# EAGLE schematic H18R11 (EAGLE 9.6.1)

## Sheet 1 of 3
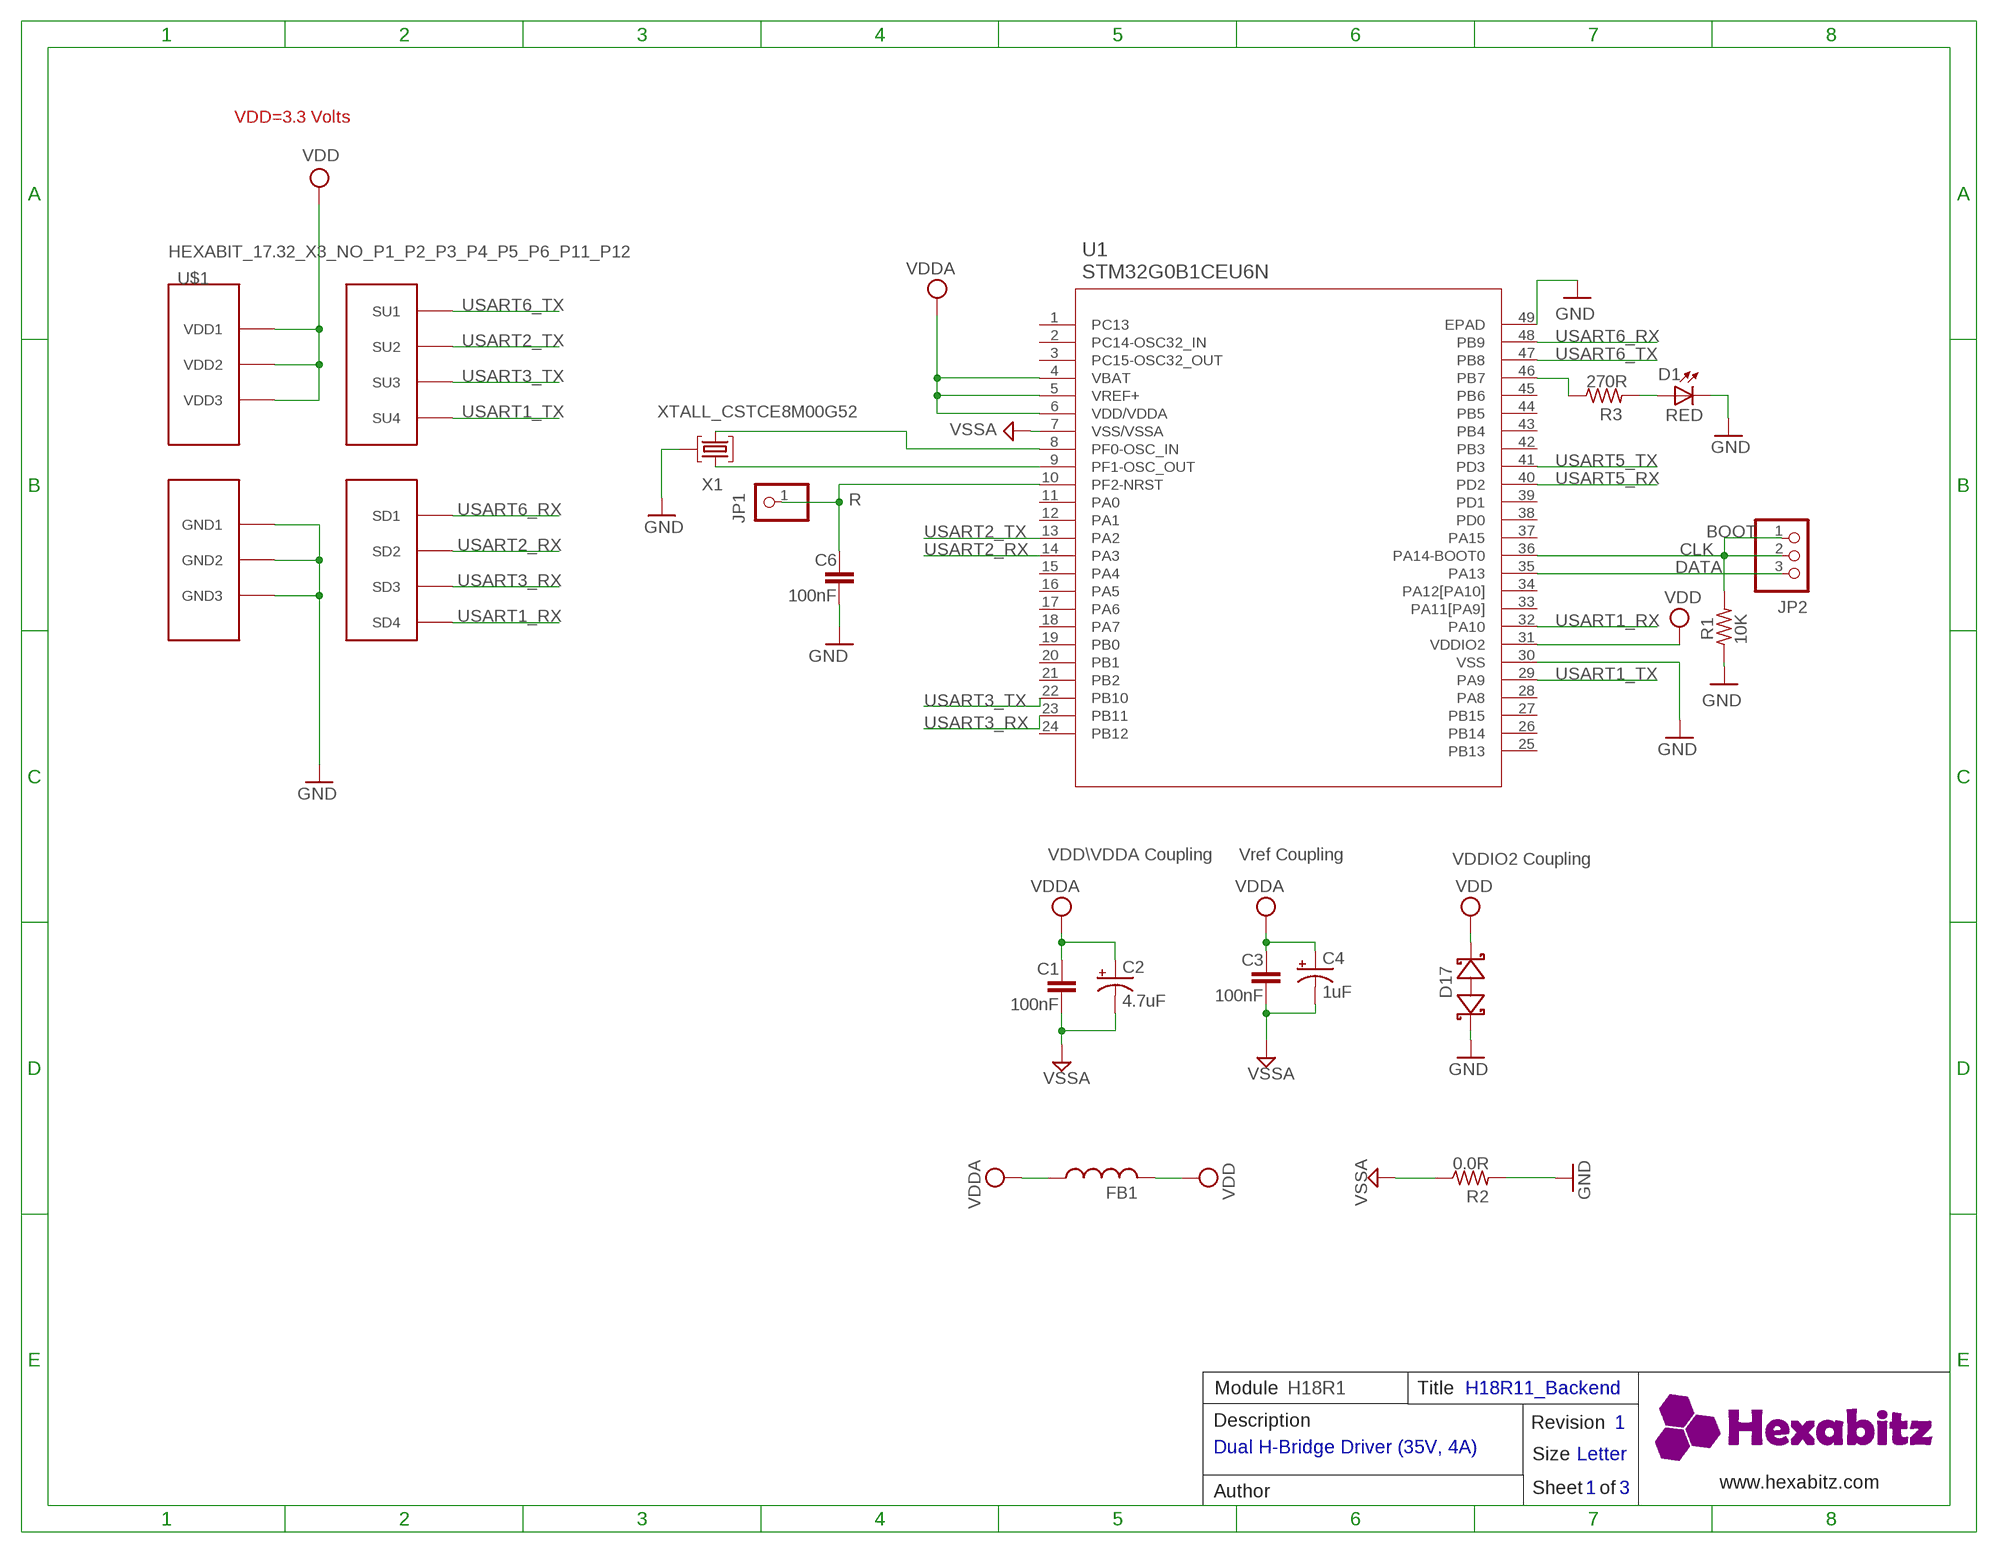
[diagram p0: schematic, sheet 1]

### Parts
C1  100nF  C-0603  [C-0603]
C2  4.7uF  C-0805-POL  [C-0805-POL]
C3  100nF  C-0603  [C-0603]
C4  1uF  C-0805-POL  [C-0805-POL]
C6  100nF  C-0603  [C-0603]
D1  RED  VLMS1300-GS08  [VLMS1300-GS08]
D17  BOURNS_CDSOD323-T03SCBOURNS_CDSOD323-T03SC_0_0  [BOURNS_CDSOD323-T03SC_0]
FB1  FB-0603  [FB-0603]
JP1  R  PINHD-1X1  [1X01]
JP2  PINHD-1X3  [1X03]
R1  10K  R-0603  [R-0603]
R2  0.0R  R-0603  [R-0603]
R3  270R  R-0603  [R-0603]
U1  STM32G0B1CEU6N  [HEXABITZ_ICS_QFN_B1CEU6_STM-L]
U$1  HEXABIT_17.32_X3_NO_P1_P2_P3_P4_P5_P6_P11_P12  [HEXABIT_17.32_X3_NO_P1_P2_P3_P4_P5_P6_P11_P12]
X1  XTALL_CSTCE8M00G52  [XTALL_CSTCE8M00G52]

### Nets
CLK: JP2.1 JP2.2 R1.2 U1.36(PA14-BOOT0)
DATA: JP2.3 U1.35(PA13)
GND: C6.2 D1.C D17.1(A) R1.1 R2.2 U1.30(VSS) U1.49(EPAD) U$1.PAD_PD12(GND1) U$1.PAD_PD17(GND2) U$1.PAD_PD19(GND3) X1.P$2 ; also sheet 2,3
N$1: D1.A R3.2
N$2: R3.1 U1.46(PB7)
N$5: U1.9(PF1-OSC_OUT) X1.P$1
N$6: U1.8(PF0-OSC_IN) X1.P$3
N$8: C6.1 JP1.1 U1.10(PF2-NRST)
USART1_RX: U1.32(PA10) U$1.PAD_PD8(SD4)
USART1_TX: U1.29(PA9) U$1.PAD_PU8(SU4)
USART2_RX: U1.14(PA3) U$1.PAD_PD1(SD2)
USART2_TX: U1.13(PA2) U$1.PAD_PU1(SU2)
USART3_RX: U1.23(PB11) U$1.PAD_PD2(SD3)
USART3_TX: U1.22(PB10) U$1.PAD_PU2(SU3)
USART5_RX: U1.40(PD2)
USART5_TX: U1.41(PD3)
USART6_RX: U1.48(PB9) U$1.PAD_PD3(SD1)
USART6_TX: U1.47(PB8) U$1.PAD_PU3(SU1)
VDD: D17.2(C) FB1.2 U1.31(VDDIO2) U$1.PAD_PU12(VDD1) U$1.PAD_PU17(VDD2) U$1.PAD_PU19(VDD3) ; also sheet 2,3
VDDA: C1.1 C2.1(+) C3.1 C4.1(+) FB1.1 U1.4(VBAT) U1.5(VREF+) U1.6(VDD/VDDA)
VSSA: C1.2 C2.2(-) C3.2 C4.2(-) R2.1 U1.7(VSS/VSSA) ; also sheet 2
Unconnected: U1.1(PC13) U1.2(PC14-OSC32_IN) U1.3(PC15-OSC32_OUT) U1.11(PA0) U1.12(PA1) U1.15(PA4) U1.16(PA5) U1.17(PA6) U1.18(PA7) U1.19(PB0) U1.20(PB1) U1.21(PB2) U1.24(PB12) U1.25(PB13) U1.26(PB14) U1.27(PB15) U1.28(PA8) U1.33(PA11[PA9]) U1.34(PA12[PA10]) U1.37(PA15) U1.38(PD0) U1.39(PD1) U1.42(PB3) U1.43(PB4) U1.44(PB5) U1.45(PB6)

### Notes on the sheet
- VDD=3.3 Volts
- BOOT
- VDD\VDDA Coupling | Vref Coupling | VDDIO2 Coupling
- Module | H18R1 | Title | H18R11_Backend
- Description | Revision | 1
- Dual H-Bridge Driver (35V, 4A)
- Size | Letter
- www.hexabitz.com
- Author | Sheet   of | 1 | 3
- C:/Users/Admin/Desktop/logodraft.bmp

## Sheet 2 of 3
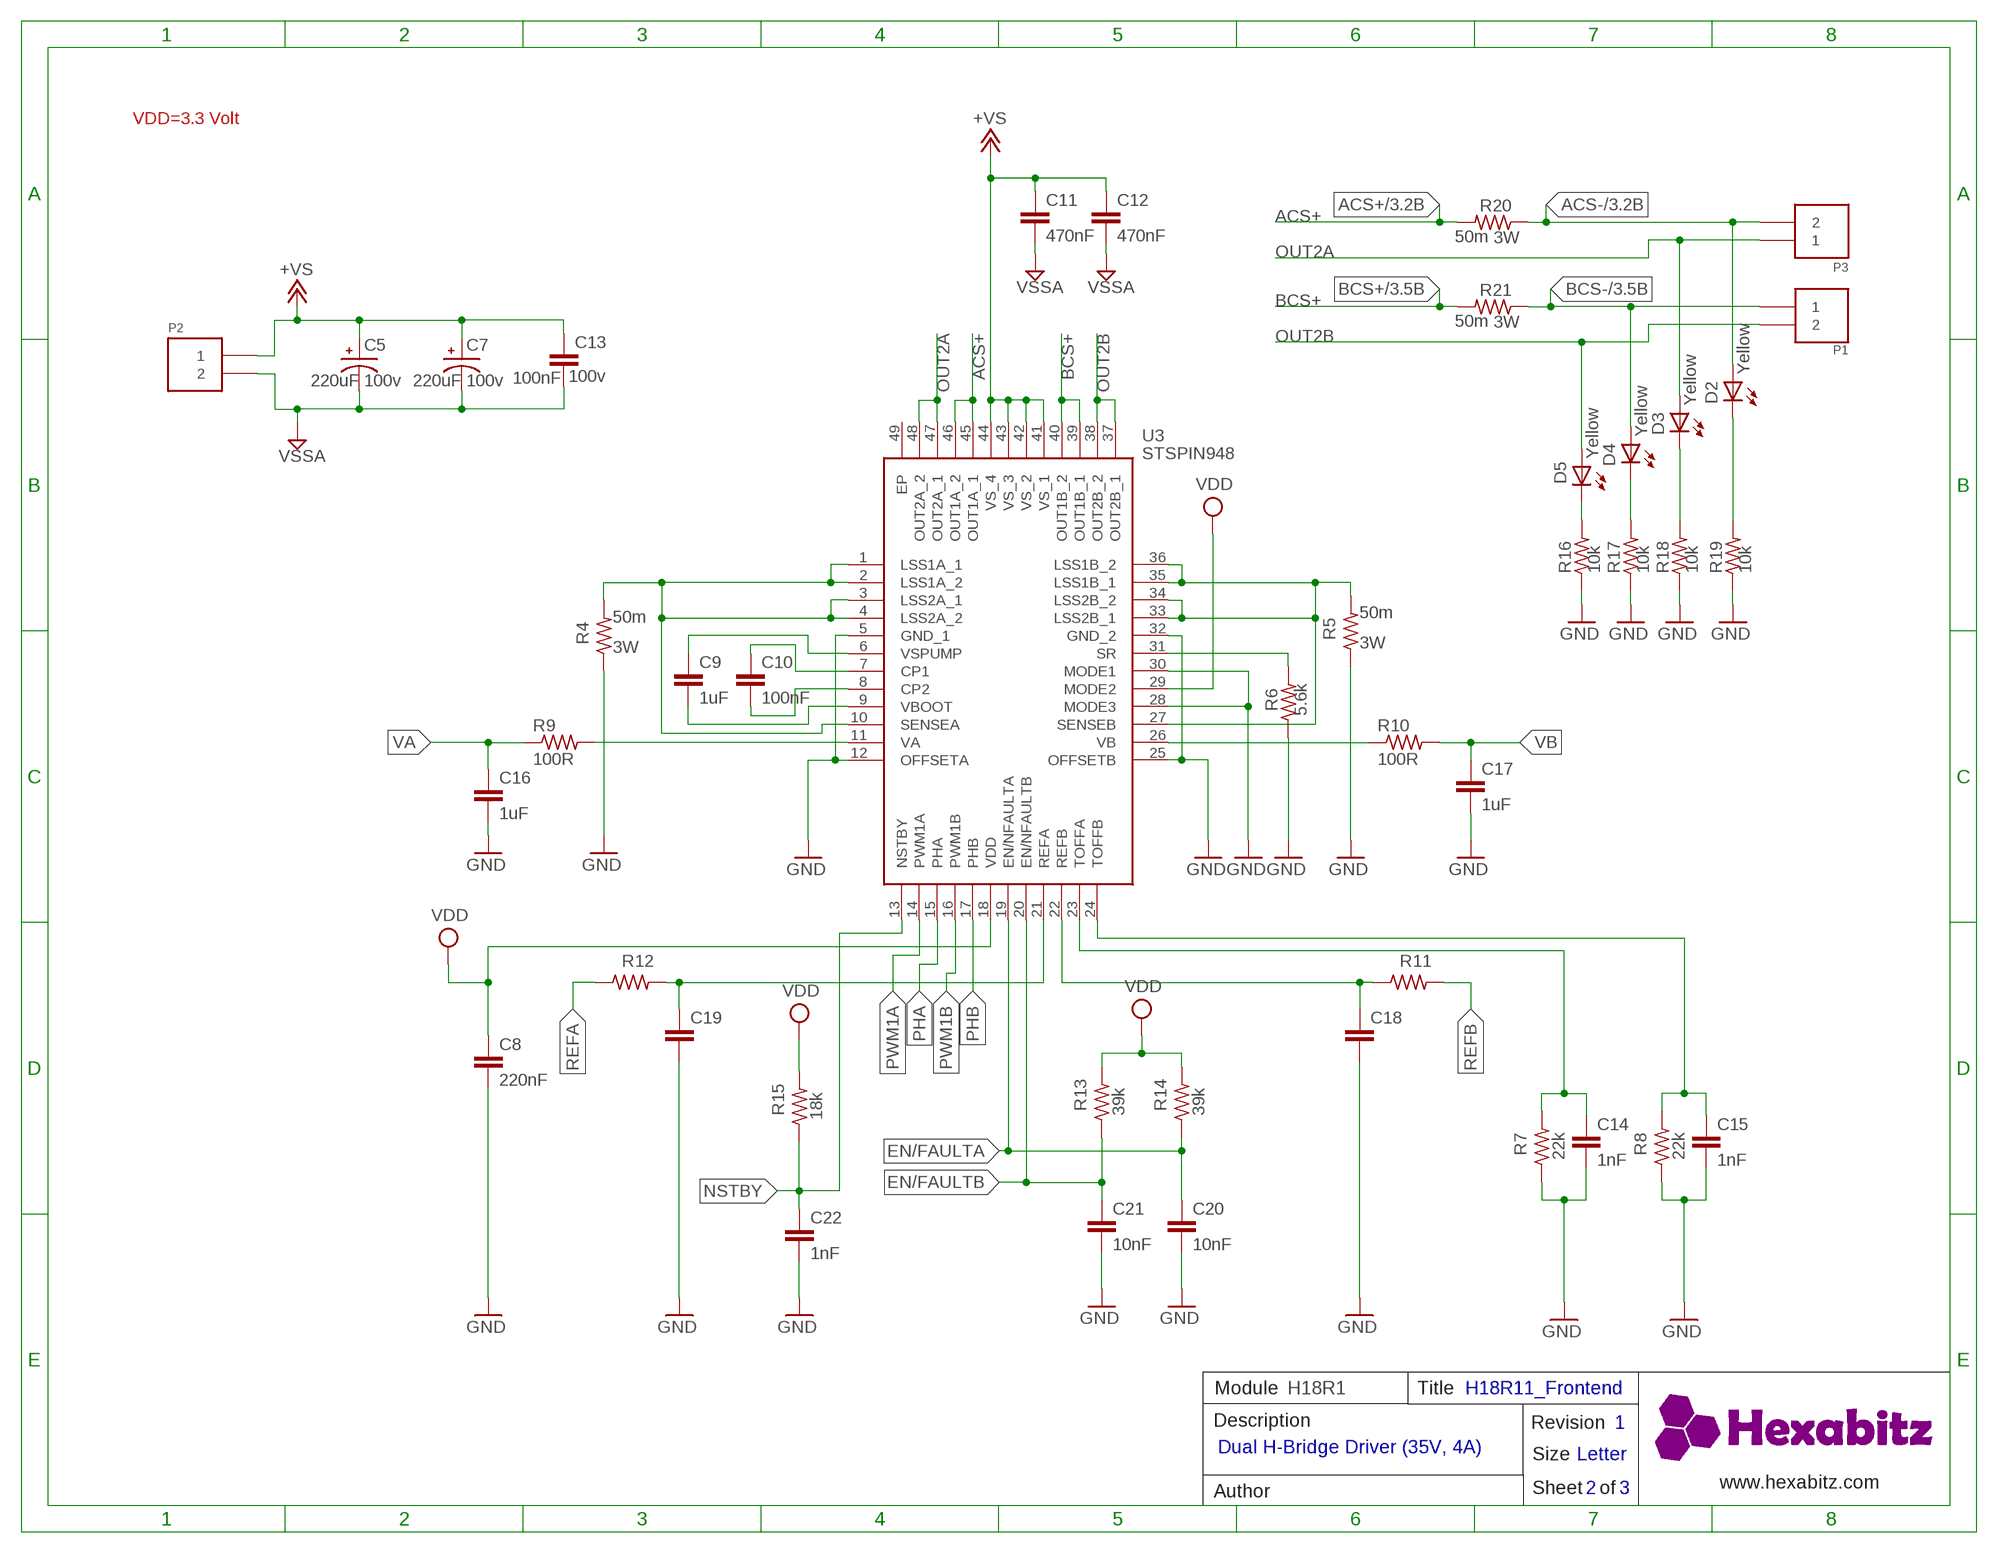
[diagram p1: schematic, sheet 2]

### Parts
C5  220uF  EEUFS2A221B  [CAPPRD500W60D1250H2500]
C7  220uF  EEUFS2A221B  [CAPPRD500W60D1250H2500]
C8  220nF  C-0603  [C-0603]
C9  1uF  C-0603  [C-0603]
C10  100nF  C-0603  [C-0603]
C11  470nF  C-0603  [C-0603]
C12  470nF  C-0603  [C-0603]
C13  100nF  C-0603  [C-0603]
C14  1nF  C-0603  [C-0603]
C15  1nF  C-0603  [C-0603]
C16  1uF  C-0603  [C-0603]
C17  1uF  C-0603  [C-0603]
C18  C-0603  [C-0603]
C19  C-0603  [C-0603]
C20  10nF  C-0603  [C-0603]
C21  10nF  C-0603  [C-0603]
C22  1nF  C-0603  [C-0603]
D2  Yellow  VLMS1300-GS08  [VLMS1300-GS08]
D3  Yellow  VLMS1300-GS08  [VLMS1300-GS08]
D4  Yellow  VLMS1300-GS08  [VLMS1300-GS08]
D5  Yellow  VLMS1300-GS08  [VLMS1300-GS08]
P1  1546111-2  [1546111-2]
P2  1546111-2  [1546111-2]
P3  1546111-2  [1546111-2]
R4  50m  R-US_R2512  [R2512]
R5  50m  R-US_R2512  [R2512]
R6  5.6k  R-0603  [R-0603]
R7  22k  R-0603  [R-0603]
R8  22k  R-0603  [R-0603]
R9  100R  R-0603  [R-0603]
R10  100R  R-0603  [R-0603]
R11  R-0603  [R-0603]
R12  R-0603  [R-0603]
R13  39k  R-0603  [R-0603]
R14  39k  R-0603  [R-0603]
R15  18k  R-0603  [R-0603]
R16  10k  R-0805  [R-0805]
R17  10k  R-0805  [R-0805]
R18  10k  R-0805  [R-0805]
R19  10k  R-0805  [R-0805]
R20  50m  R-US_R2512  [R2512]
R21  50m  R-US_R2512  [R2512]
U3  STSPIN948  [QFN50P700X700X105-49N]

### Nets
+VS: C5.P C7.P C11.1 C12.1 C13.1 P2.1 U3.41(VS_1) U3.42(VS_2) U3.43(VS_3) U3.44(VS_4)
ACS+: R20.2 U3.45(OUT1A_1) U3.46(OUT1A_2) ; also sheet 3
ACS-: D2.A P3.2 R20.1 ; also sheet 3
BCS+: R21.2 U3.39(OUT1B_1) U3.40(OUT1B_2) ; also sheet 3
BCS-: D4.A P1.1 R21.1 ; also sheet 3
EN/FAULTA: C20.1 R14.1 U3.19(EN/NFAULTA)
EN/FAULTB: C21.1 R13.1 U3.20(EN/NFAULTB)
GND: C8.2 C14.2 C15.2 C16.2 C17.2 C18.2 C19.2 C20.2 C21.2 C22.2 R4.1 R5.1 R6.1 R7.1 R8.1 R16.1 R17.1 R18.1 R19.1 U3.5(GND_1) U3.12(OFFSETA) U3.25(OFFSETB) U3.28(MODE3) U3.30(MODE1) U3.32(GND_2) ; also sheet 1,3
N$3: C9.1 U3.6(VSPUMP)
N$4: C9.2 U3.9(VBOOT)
N$7: C10.1 U3.7(CP1)
N$9: C10.2 U3.8(CP2)
N$10: R4.2 U3.1(LSS1A_1) U3.2(LSS1A_2) U3.3(LSS2A_1) U3.4(LSS2A_2) U3.10(SENSEA)
N$11: R5.2 U3.27(SENSEB) U3.33(LSS2B_1) U3.34(LSS2B_2) U3.35(LSS1B_1) U3.36(LSS1B_2)
N$12: R6.2 U3.31(SR)
N$13: C14.1 R7.2 U3.23(TOFFA)
N$14: R9.2 U3.11(VA)
N$15: R10.1 U3.26(VB)
N$16: C15.1 R8.2 U3.24(TOFFB)
N$17: C19.1 R12.2 U3.21(REFA)
N$18: C18.1 R11.1 U3.22(REFB)
N$19: D3.C R18.2
N$21: D5.C R16.2
N$22: D4.C R17.2
N$23: D2.C R19.2
NSTBY: C22.1 R15.1 U3.13(NSTBY)
OUT2A: D3.A P3.1 U3.47(OUT2A_1) U3.48(OUT2A_2)
OUT2B: D5.A P1.2 U3.37(OUT2B_1) U3.38(OUT2B_2)
PHA: U3.15(PHA)
PHB: U3.17(PHB)
PWM1A: U3.14(PWM1A)
PWM1B: U3.16(PWM1B)
REFA: R12.1
REFB: R11.2
VA: C16.1 R9.1
VB: C17.1 R10.2
VDD: C8.1 R13.2 R14.2 R15.2 U3.18(VDD) U3.29(MODE2) ; also sheet 1,3
VSSA: C5.N C7.N C11.2 C12.2 C13.2 P2.2 ; also sheet 1
Unconnected: U3.49(EP)

### Notes on the sheet
- VDD=3.3 Volt
- Module | H18R1 | Title | H18R11_Frontend
- Description | Revision | 1
- Dual H-Bridge Driver (35V, 4A)
- Size | Letter
- www.hexabitz.com
- Author | Sheet   of | 2 | 3
- C:/Users/Admin/Desktop/logodraft.bmp

## Sheet 3 of 3
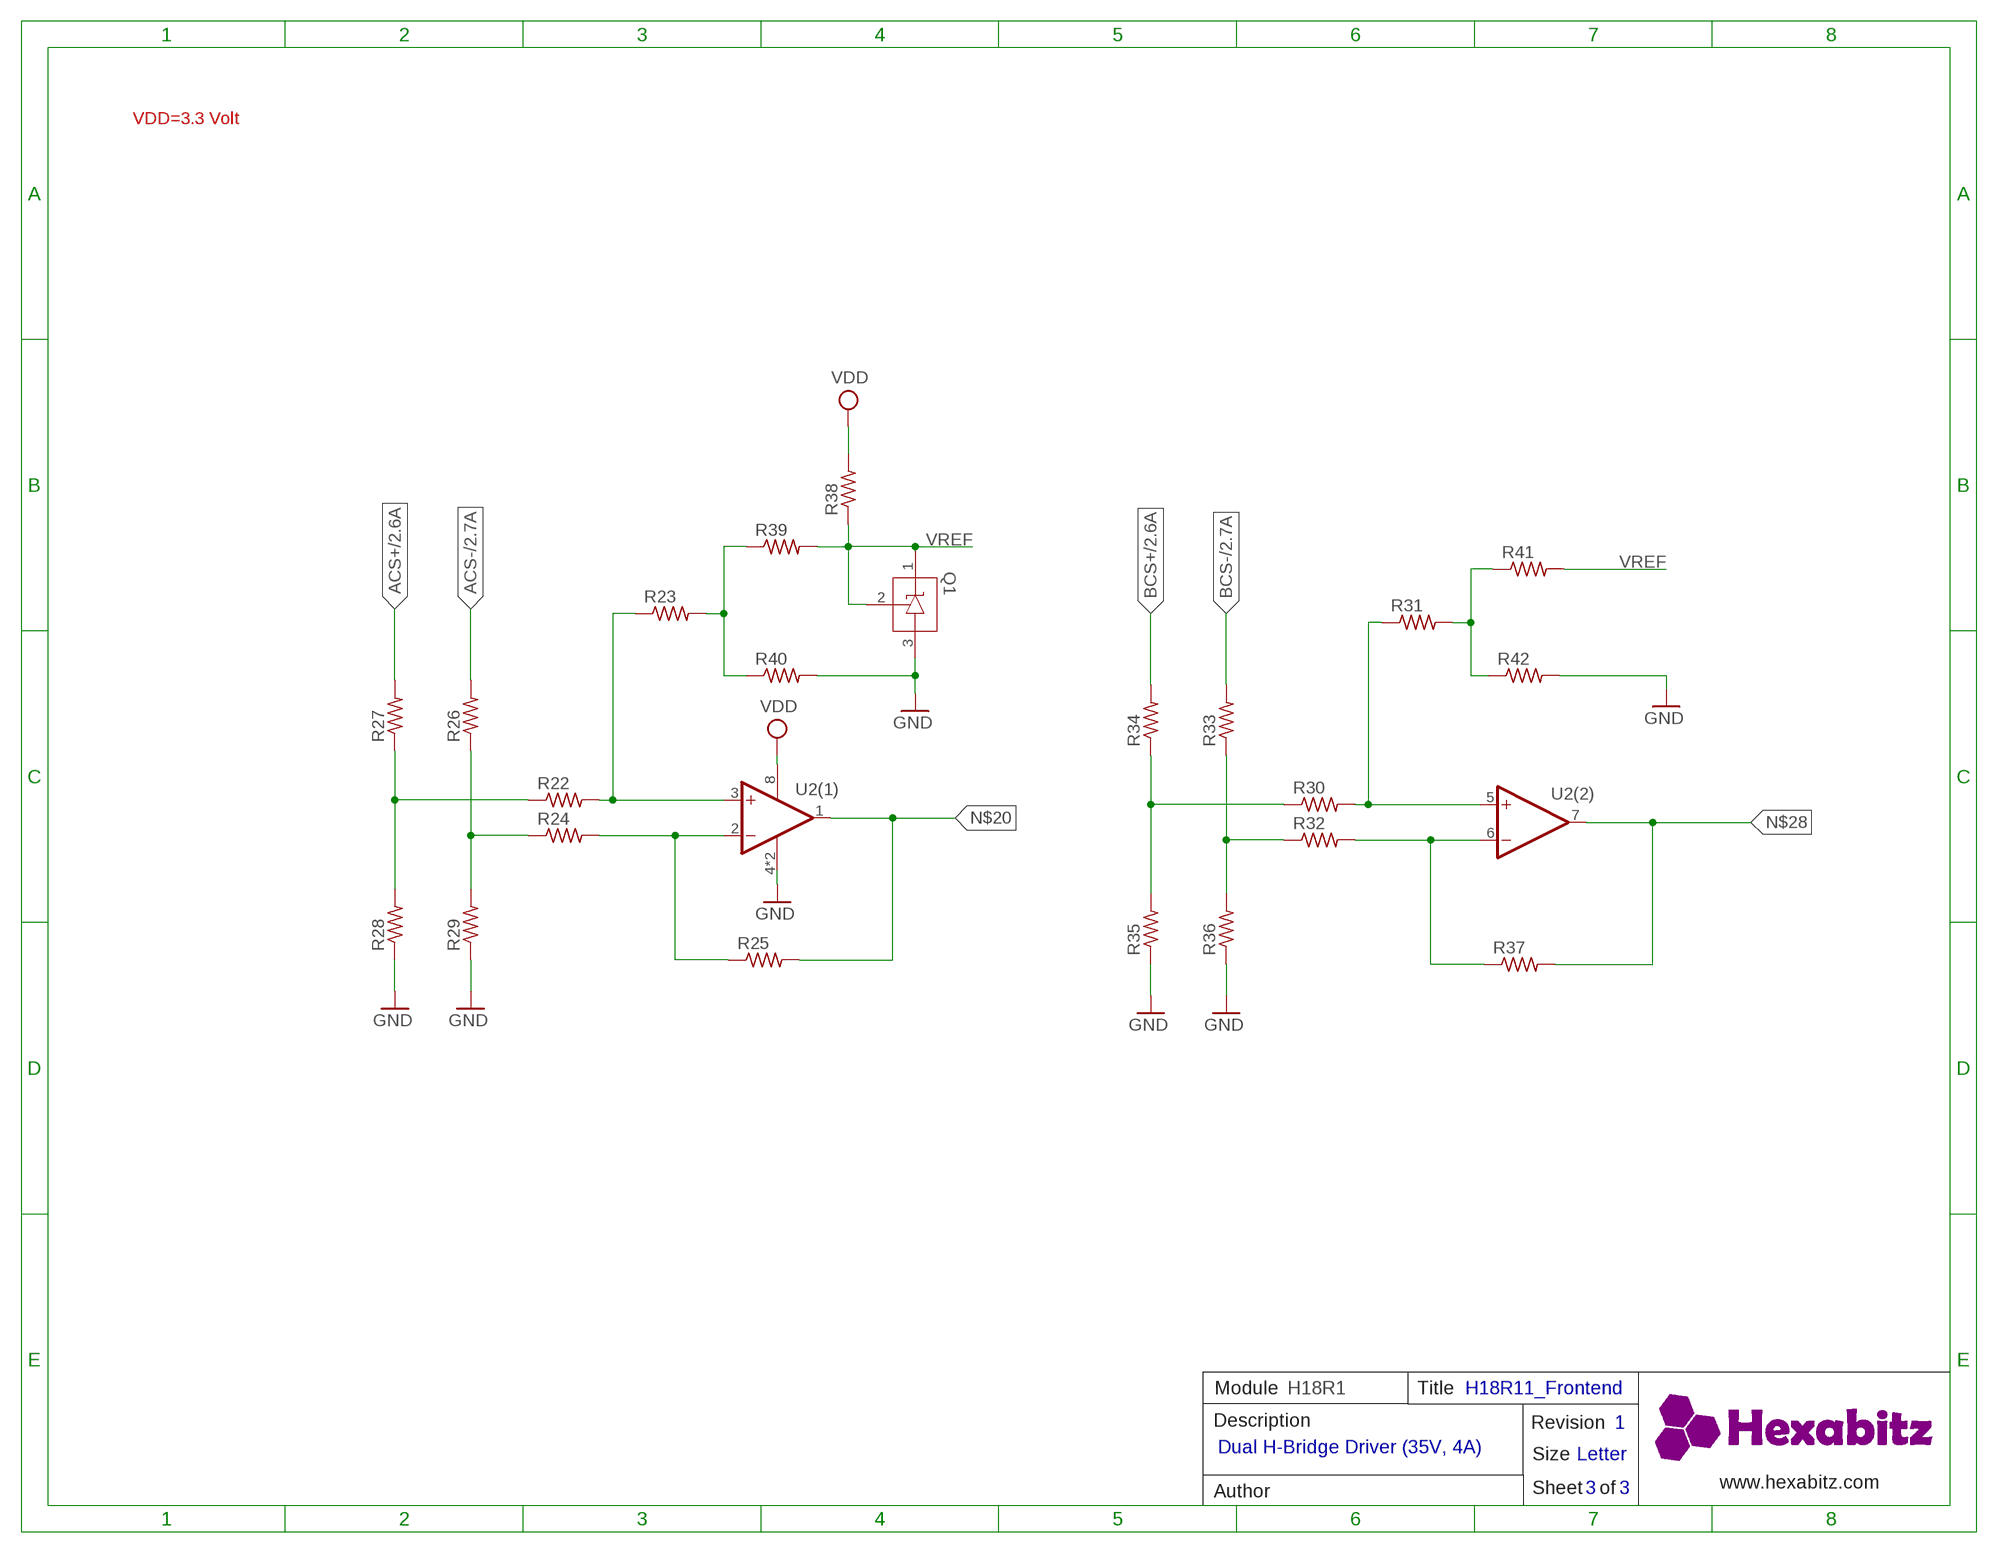
[diagram p2: schematic, sheet 3]

### Parts
Q1  TL431QDBZR,215  [SOT23_TO-236AB_NEX]
R22  R-0402  [R-0402]
R23  R-0402  [R-0402]
R24  R-0402  [R-0402]
R25  R-0402  [R-0402]
R26  R-0402  [R-0402]
R27  R-0402  [R-0402]
R28  R-0402  [R-0402]
R29  R-0402  [R-0402]
R30  R-0402  [R-0402]
R31  R-0402  [R-0402]
R32  R-0402  [R-0402]
R33  R-0402  [R-0402]
R34  R-0402  [R-0402]
R35  R-0402  [R-0402]
R36  R-0402  [R-0402]
R37  R-0402  [R-0402]
R38  R-0402  [R-0402]
R39  R-0402  [R-0402]
R40  R-0402  [R-0402]
R41  R-0402  [R-0402]
R42  R-0402  [R-0402]
U2  TSV772IQ2T_SEPARATED_SYMBOLSSON50P200X200X60-9N  [SON50P200X200X60-9N]

### Nets
ACS+: R27.2 ; also sheet 2
ACS-: R26.2 ; also sheet 2
BCS+: R34.2 ; also sheet 2
BCS-: R33.2 ; also sheet 2
GND: Q1.3 R28.1 R29.1 R35.1 R36.1 R40.2 R42.2 U2.4(P:V-) U2.9(P:V-) ; also sheet 1,2
N$20: R25.2 U2.1((1):OUT)
N$24: R24.2 R25.1 U2.2((1):-IN)
N$25: R31.2 R41.1 R42.1
N$26: R24.1 R26.1 R29.2
N$27: R22.1 R27.1 R28.2
N$28: R37.2 U2.7((2):OUT)
N$29: R32.2 R37.1 U2.6((2):-IN)
N$31: R32.1 R33.1 R36.2
N$32: R30.1 R34.1 R35.2
N$33: R22.2 R23.1 U2.3((1):+IN)
N$34: R23.2 R39.1 R40.1
VDD: R38.2 U2.8(P:V+) ; also sheet 1,2
VREF: Q1.1 Q1.2 R30.2 R31.1 R38.1 R39.2 R41.2 U2.5((2):+IN)

### Notes on the sheet
- VDD=3.3 Volt
- Module | H18R1 | Title | H18R11_Frontend
- Description | Revision | 1
- Dual H-Bridge Driver (35V, 4A)
- Size | Letter
- www.hexabitz.com
- Author | Sheet   of | 3 | 3
- C:/Users/Admin/Desktop/logodraft.bmp

## Library data of the parts
C1 C3 C6 C8-C12 C14-C22 = HEXABITZ_RCLS:C-0603: CAP CER 10% X7R 0603
C2 C4 = HEXABITZ_RCLS:C-0805-POL: Cap Tant Solid SMD 2012
C5 C7 = HEXABITZ_RCLS:EEUFS2A221B: FS-A Check availability <https://pricing.snapeda.com/parts/EEU-FS2A221B/Panasonic%20Electronic%20Components/view-part?ref=eda>; AVAILABILITY: In Stock; CHECK_PRICES: https://www.snapeda.com/parts/EEU-FS2A221B/Panasonic+Electronic+Components/view-part/?ref=eda; DESCRIPTION: CAP ALUM 220UF 20% 100V THRUHOLE; MF: Panasonic Electronic Components; MP: EEU-FS2A221B; PACKAGE: RADIAL-2 Panasonic; PRICE: None; SNAPEDA_LINK: https://www.snapeda.com/parts/EEU-FS2A221B/Panasonic+Electronic+Components/view-part/?ref=snap; VOLT: 100v
C13 = HEXABITZ_RCLS:C-0603: CAP CER 10% X7R 0603; VOLTAGE_RATING: 100v
D1 = Hexabitz:VLMS1300-GS08: Red 0603 130° Clear 54 mcd 2 V Surface Mount ChipLED ; Octopart Url : http://octopart.com/vlms1300-gs08-vishay-21709201; MFN: Vishay; MPN: VLMS1300-GS08; OCTOPART_URL: https://octopart.com/vlms1300-gs08-vishay-21709201?r=sp&s=_gcP4_q8T1SC6PJQPTQ9yA
D2-D5 = Hexabitz:VLMS1300-GS08: Red 0603 130° Clear 54 mcd 2 V Surface Mount ChipLED ; Octopart Url : http://octopart.com/vlms1300-gs08-vishay-21709201; MFN: Vishay; MPN: VLMS1300-GS08; OCTOPART_URL: https://octopart.com/vlms1300-gs08-vishay-21709201?r=sp&s=_gcP4_q8T1SC6PJQPTQ9yA; VALUE: RED
D17 = HEXABITZ_RCLS:BOURNS_CDSOD323-T03SC: CDSOD323-TxxSC - TVS Diode Series; DESCRIPTION: Dio Tvs Vwm 03V 500W Bidir Sod323 / Tape & Reel - 7" Reel; MFN: Bourns; MPN: CDSOD323-T03SC; OCTOPART_URL: https://octopart.com/cdsod323-t03sc-bourns-10487153?r=sp
FB1 = HEXABITZ_RCLS:FB-0603: Ferrite Beads Multi-Layer 0603
JP1 = HEXABITZ_USER_INTERFACE_PARTS:PINHD-1X1: PIN HEADER; MFN: TE Connectivity; MPN: 87227-1; OCTOPART_URL: https://octopart.com/87227-1-te+connectivity-39512052?r=sp
JP2 = pinhead:PINHD-1X3: PIN HEADER
P1-P3 = HEXABITZ_CONNECTION_PARTS:1546111-2: Conn Shrouded Header HDR 2 POS 5.08mm Solder ST Thru-Hole; MFN: TE Connectivity; MPN: 1546111-2; OCTOPART_URL: https://octopart.com/1546111-2-te+connectivity-40393355
Q1 = HEXABITZ_RCLS:TL431QDBZR,215; COPYRIGHT: Copyright (C) 2022 Ultra Librarian. All rights reserved.; MANUFACTURER_PART_NUMBER: TL431QDBZR,215; MFR_NAME: Nexperia
R1-R3 R6-R15 = HEXABITZ_RCLS:R-0603: Thick Film Resistors - SMD 0603
R4 R5 R20 R21 = HEXABITZ_RCLS:R-US_: RESISTOR, American symbol; MPN: CRA2512-FZ-R050ELF; POWER: 3W; SPICEPREFIX: R; URL: https://octopart.com/cra2512-fz-r050elf-bourns-7483588
R16-R19 = HEXABITZ_RCLS:R-0805: Thick Film Resistors - SMD 0605
R22-R42 = HEXABITZ_RCLS:R-0402: Thick Film Resistors - SMD 0603
U1 = HEXABITZ_ICs:STM32G0B1CEU6N
U2 = HEXABITZ_ICs:TSV772IQ2T_SEPARATED_SYMBOLS: OP AMP also LM158; LM258; LM2904 Source: http://cache.national.com/ds/LM/LM158.pdf
U3 = HEXABITZ_ICs:STSPIN948: Scalable 4.5 A dual full-bridge driver for brushed DC motors Source: Datasheet <https://www.st.com/resource/en/datasheet/stspin948.pdf>; ARROW_PART_NUMBER: STSPIN948; ARROW_PRICE-STOCK: https://www.arrow.com/en/products/stspin948/stmicroelectronics?region=nac; DESCRIPTION: Scalable 4.5 A dual full-bridge driver for brushed DC motors; HEIGHT: 1.05mm; MANUFACTURER_NAME: STMicroelectronics; MANUFACTURER_PART_NUMBER: STSPIN948; MOUSER_PART_NUMBER: 511-STSPIN948; MOUSER_PRICE-STOCK: https://www.mouser.co.uk/ProductDetail/STMicroelectronics/STSPIN948?qs=HoCaDK9Nz5dn6g8dp5VAVQ%3D%3D
U$1 = hexabitz_connectors:HEXABIT_17.32_X3_NO_P1_P2_P3_P4_P5_P6_P11_P12
X1 = Hexabitz:XTALL_CSTCE8M00G52: MURATA CSTCE8M00G52-R0 RESONATOR, SMD, 8MHZ ; Octopart Url : https://octopart.com/cstce8m00g52-r0-murata-7145559; MFN: Murata; MPN: CSTCE8M00G52Z-R0; OCTOPART_URL: https://octopart.com/cstce8m00g52z-r0-murata-17755941?r=sp&s=JDnNJnrHQhyS8Zk4ofFWXw